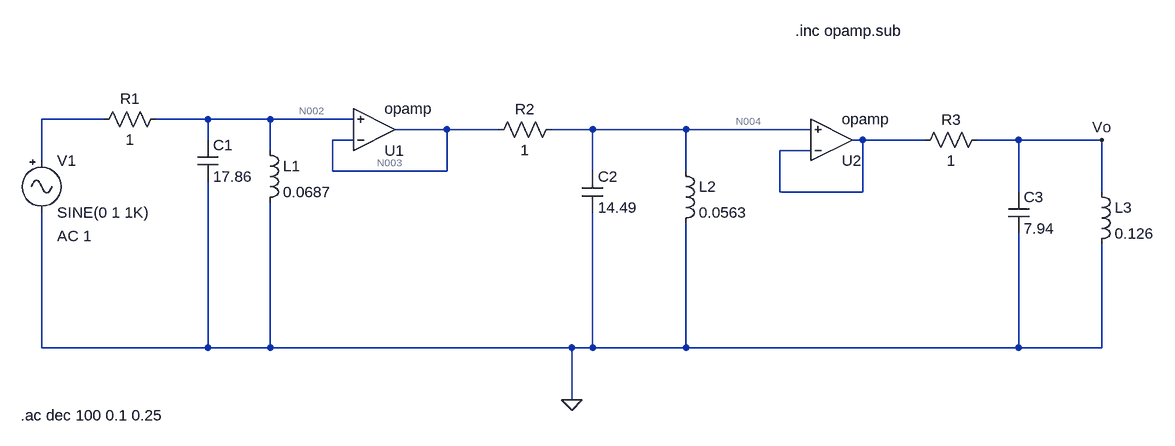
[diagram p0: schematic TS4-Pasivo.asc]
TS4-Pasivo.asc, the LTspice schematic file:
Version 4
SHEET 1 1720 680
WIRE 96 80 0 80
WIRE 256 80 176 80
WIRE 352 80 256 80
WIRE 480 80 352 80
WIRE 624 96 544 96
WIRE 704 96 624 96
WIRE 848 96 784 96
WIRE 992 96 848 96
WIRE 1184 96 992 96
WIRE 256 112 256 80
WIRE 480 112 448 112
WIRE 1264 112 1248 112
WIRE 1360 112 1264 112
WIRE 1504 112 1440 112
WIRE 1632 112 1504 112
WIRE 352 128 352 80
WIRE 1184 128 1136 128
WIRE 0 144 0 80
WIRE 448 160 448 112
WIRE 624 160 624 96
WIRE 624 160 448 160
WIRE 848 160 848 96
WIRE 992 160 992 96
WIRE 1136 192 1136 128
WIRE 1264 192 1264 112
WIRE 1264 192 1136 192
WIRE 1504 192 1504 112
WIRE 1632 192 1632 112
WIRE 0 432 0 224
WIRE 256 432 256 176
WIRE 256 432 0 432
WIRE 352 432 352 208
WIRE 352 432 256 432
WIRE 816 432 352 432
WIRE 848 432 848 224
WIRE 848 432 816 432
WIRE 992 432 992 240
WIRE 992 432 848 432
WIRE 1504 432 1504 256
WIRE 1504 432 992 432
WIRE 1632 432 1632 272
WIRE 1632 432 1504 432
WIRE 816 512 816 432
FLAG 1632 112 Vo
FLAG 816 512 0
SYMBOL Misc\\signal 0 128 R0
WINDOW 123 24 132 Left 2
WINDOW 39 0 0 Left 0
SYMATTR Value2 AC 1
SYMATTR InstName V1
SYMBOL res 192 64 R90
WINDOW 0 0 56 VBottom 2
WINDOW 3 32 56 VTop 2
SYMATTR InstName R1
SYMATTR Value 1
SYMBOL cap 240 112 R0
SYMATTR InstName C1
SYMATTR Value 17.86
SYMBOL ind 336 112 R0
SYMATTR InstName L1
SYMATTR Value 0.0687
SYMBOL OpAmps\\opamp 512 160 M180
SYMATTR InstName U1
SYMBOL res 800 80 R90
WINDOW 0 0 56 VBottom 2
WINDOW 3 32 56 VTop 2
SYMATTR InstName R2
SYMATTR Value 1
SYMBOL cap 832 160 R0
SYMATTR InstName C2
SYMATTR Value 14.49
SYMBOL ind 976 144 R0
SYMATTR InstName L2
SYMATTR Value 0.0563
SYMBOL OpAmps\\opamp 1216 176 M180
SYMATTR InstName U2
SYMBOL res 1456 96 R90
WINDOW 0 0 56 VBottom 2
WINDOW 3 32 56 VTop 2
SYMATTR InstName R3
SYMATTR Value 1
SYMBOL cap 1488 192 R0
SYMATTR InstName C3
SYMATTR Value 7.94
SYMBOL ind 1616 176 R0
SYMATTR InstName L3
SYMATTR Value 0.126
TEXT 1160 -56 Left 2 !.inc opamp.sub
TEXT -32 536 Left 2 !.ac dec 100 0.1 0.25

The netlist it stands for:
* TS4-Pasivo.asc
V1 N001 0 SINE(0 1 1K) AC 1
R1 N002 N001 1
C1 N002 0 17.86
L1 N002 0 0.0687
XU1 N003 N002 N003 opamp Aol=100K GBW=10Meg  ; pins invin noninvin out
R2 N004 N003 1
C2 N004 0 14.49
L2 N004 0 0.0563
XU2 N005 N004 N005 opamp Aol=100K GBW=10Meg  ; pins invin noninvin out
R3 Vo N005 1
C3 Vo 0 7.94
L3 Vo 0 0.126
.inc opamp.sub
.ac dec 100 0.1 0.25
.backanno
.end

* Results of the author's LTspice run, read from the files saved beside the schematic
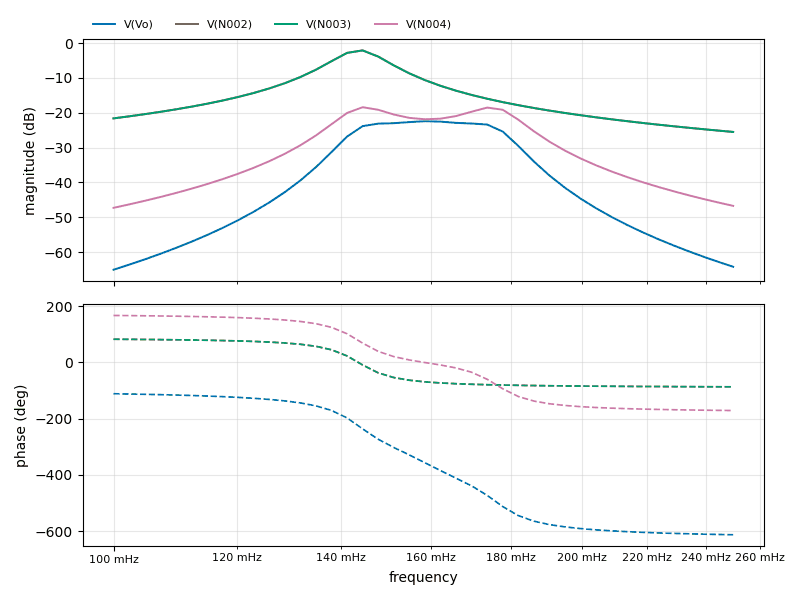
[diagram p1: AC Analysis of TS4-Pasivo.asc, plotted from the saved traces]
* AC Analysis, 1 run:
*   V(Vo): -65.05 dB at 100 mHz, -64.20 dB at 250 mHz, peak -22.41 dB at 158.5 mHz, 3 dB below the peak at 142.8 mHz and 177.9 mHz
*   V(N002): -21.61 dB at 100 mHz, -25.49 dB at 250 mHz, peak -2.09 dB at 144.5 mHz, 3 dB below the peak at 138.2 mHz and 149.6 mHz
*   V(N003): -21.61 dB at 100 mHz, -25.49 dB at 250 mHz, peak -2.09 dB at 144.5 mHz, 3 dB below the peak at 138.2 mHz and 149.6 mHz
*   V(N004): -47.28 dB at 100 mHz, -46.71 dB at 250 mHz, peak -18.40 dB at 144.5 mHz, 3 dB below the peak at 139.9 mHz and 154.7 mHz